# Altium project QR_Scanning_v1.STM32F401RE.PrjPcb
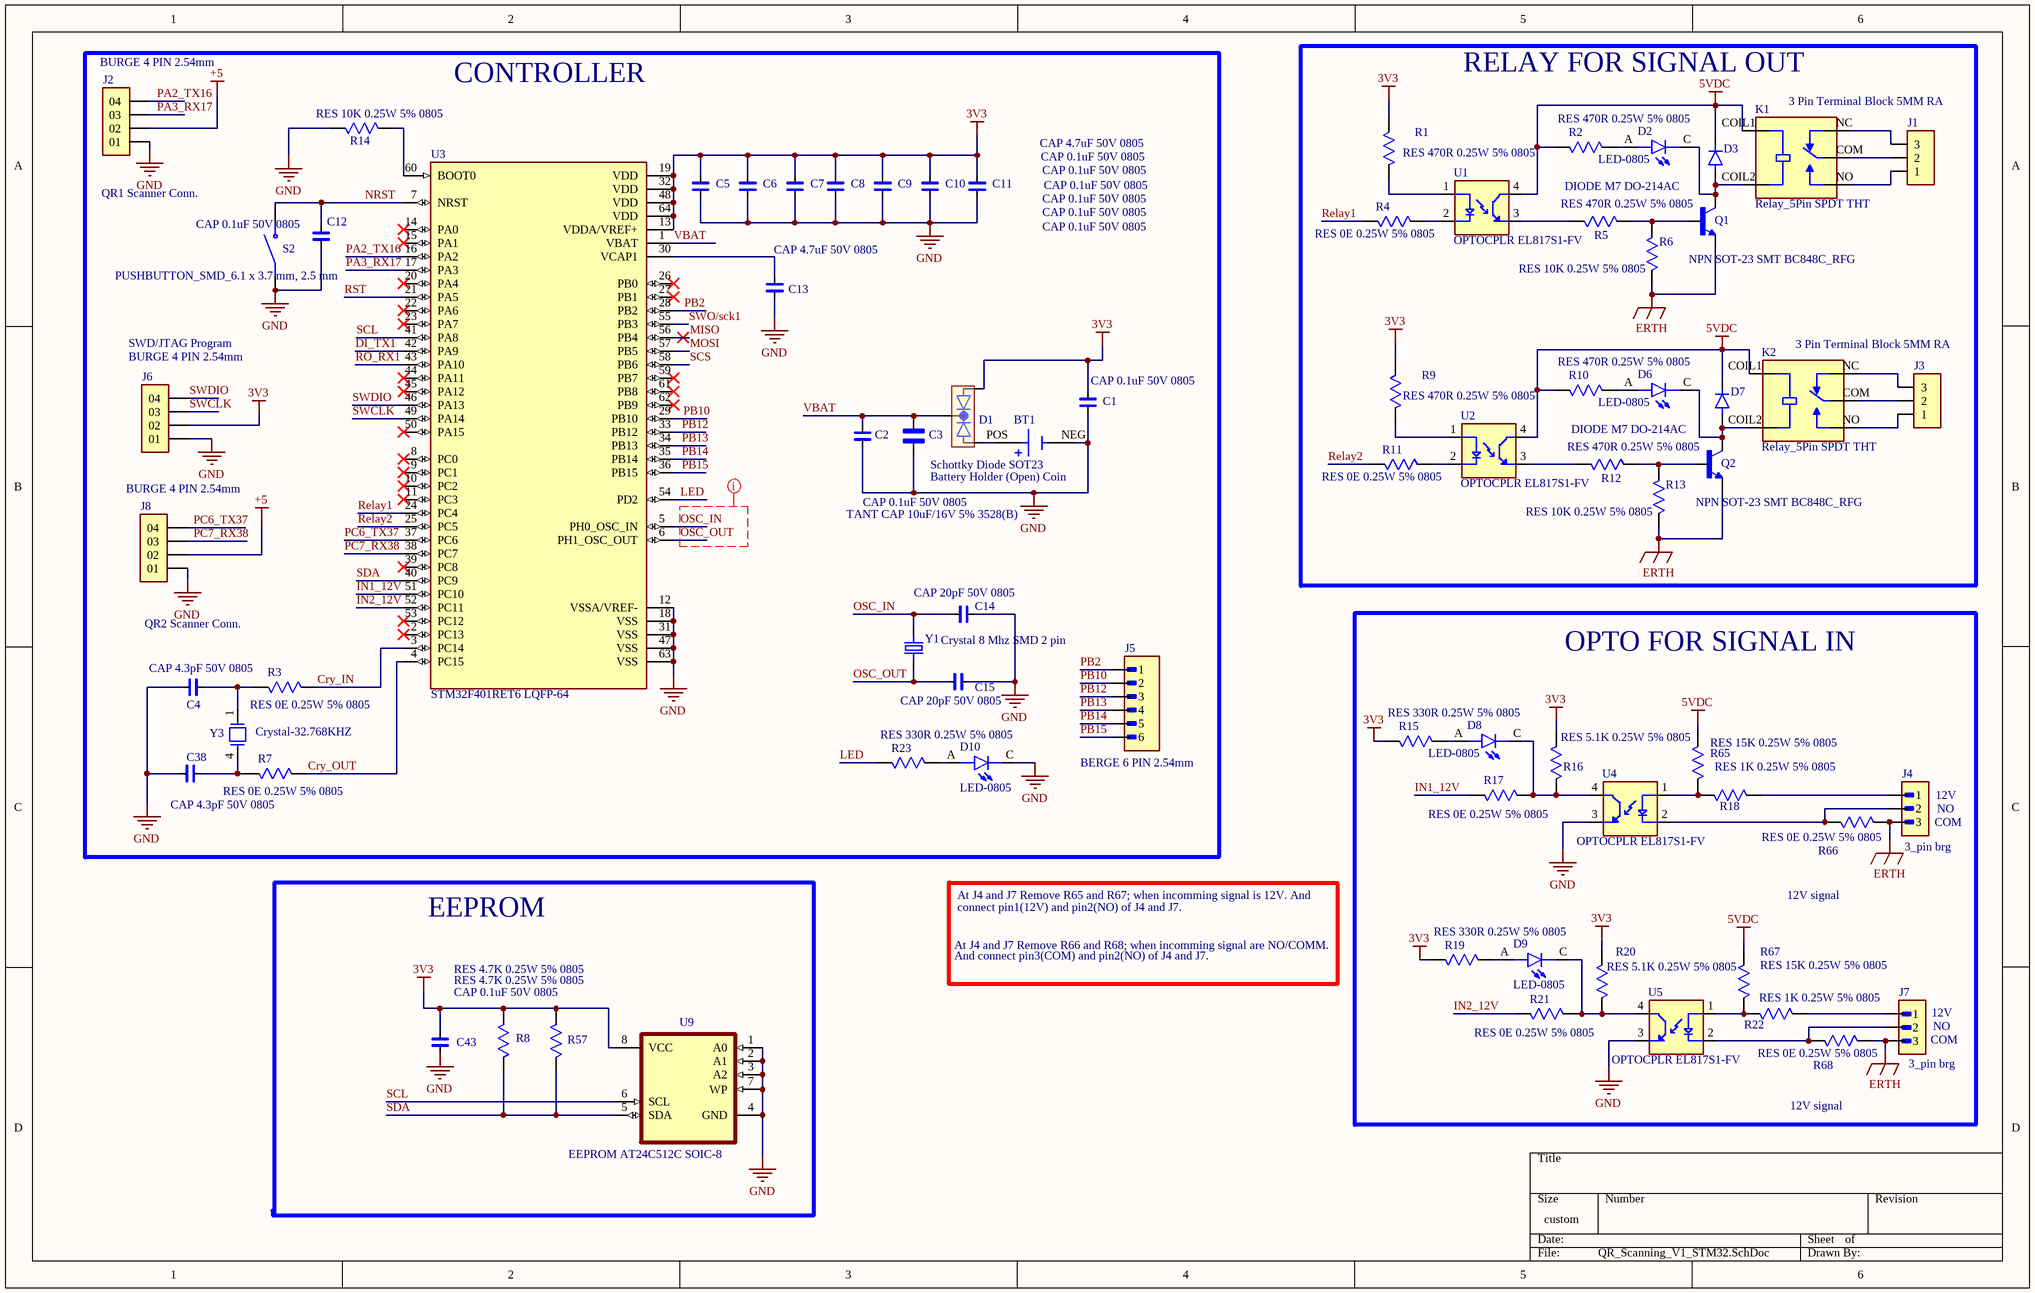
[diagram p0: QR_Scanning_V1_STM32.SchDoc]
3 sheets, 184 parts. Net scope: global (net labels, ports and power ports of the same name join across sheets).
Board file: QR_Scanning_V1_STM32.PcbDoc
Sheets:
  QR_Scanning_V1_STM32.SchDoc
  QR_Scanning1_V1_STM32.SchDoc
  QR_Scanning2_V1_STM32.SchDoc

## Sheet QR_Scanning_V1_STM32.SchDoc
size 381 x 241 mm; SheetNumber: 1; SheetTotal: 3

### Parts
BT1  Battery Holder (Open) Coin  [Battery Holder (Open) Coin]
C1  CAP 0.1uF 50V 0805  [CAP CER 0.1uF/50V 5%]
C2  CAP 0.1uF 50V 0805  [CAP CER 0.1uF/50V 5%]
C3  TANT CAP 10uF/16V 5% 3528(B)  [TANT CAP 3528(B)]
C4  CAP 4.3pF 50V 0805  [CAP CER 0.1uF/50V 5%]
C5  CAP 0.1uF 50V 0805  [CAP CER 0.1uF/50V 5%]
C6  CAP 0.1uF 50V 0805  [CAP CER 0.1uF/50V 5%]
C7  CAP 0.1uF 50V 0805  [CAP CER 0.1uF/50V 5%]
C8  CAP 0.1uF 50V 0805  [CAP CER 0.1uF/50V 5%]
C9  CAP 0.1uF 50V 0805  [CAP CER 0.1uF/50V 5%]
C10  CAP 0.1uF 50V 0805  [CAP CER 0.1uF/50V 5%]
C11  CAP 4.7uF 50V 0805  [CAP CER 0.1uF/50V 5%]
C12  CAP 0.1uF 50V 0805  [CAP CER 0.1uF/50V 5%]
C13  CAP 4.7uF 50V 0805  [CAP CER 0.1uF/50V 5%]
C14  CAP 20pF 50V 0805  [CAP CER 0.1uF/50V 5%]
C15  CAP 20pF 50V 0805  [CAP CER 0.1uF/50V 5%]
C38  CAP 4.3pF 50V 0805  [CAP CER 0.1uF/50V 5%]
C43  CAP 0.1uF 50V 0805  [CAP CER 0.1uF/50V 5%]
D1  Schottky Diode SOT23  [Schottky Diode SOT23 BAT54C]
D2  LED-0805  [LED-0805]
D3  DIODE M7 DO-214AC  [DIODE M7 DO-214AC]
D6  LED-0805  [LED-0805]
D7  DIODE M7 DO-214AC  [DIODE M7 DO-214AC]
D8  LED-0805  [LED-0805]
D9  LED-0805  [LED-0805]
D10  LED-0805  [LED-0805]
J1  3 Pin Terminal Block 5MM RA  [3 Pin Terminal Block 5MM RA]
J2  BURGE 4 PIN 2.54mm  [BURGE 4 PIN 2.54mm]
J3  3 Pin Terminal Block 5MM RA  [3 Pin Terminal Block 5MM RA]
J4  3_pin brg  [3_pin brg]
J5  BERGE 6 PIN 2.54mm  [BERGE 6 PIN 2.54mm]
J6  BURGE 4 PIN 2.54mm  [BURGE 4 PIN 2.54mm]
J7  3_pin brg  [3_pin brg]
J8  BURGE 4 PIN 2.54mm  [BURGE 4 PIN 2.54mm]
K1  Relay_5Pin SPDT THT  [Relay_5Pin SPDT THT]
K2  Relay_5Pin SPDT THT  [Relay_5Pin SPDT THT]
Q1  NPN SOT-23 SMT BC848C_RFG  [NPN SOT-23 SMT BC848C_RFG]
Q2  NPN SOT-23 SMT BC848C_RFG  [NPN SOT-23 SMT BC848C_RFG]
R1  RES 470R 0.25W 5% 0805  [RES 0805 10K/0.25W 5%]
R2  RES 470R 0.25W 5% 0805  [RES 0805 10K/0.25W 5%]
R3  RES 0E 0.25W 5% 0805  [RES 0805 10K/0.25W 5%]
R4  RES 0E 0.25W 5% 0805  [RES 0805 10K/0.25W 5%]
R5  RES 470R 0.25W 5% 0805  [RES 0805 10K/0.25W 5%]
R6  RES 10K 0.25W 5% 0805  [RES 0805 10K/0.25W 5%]
R7  RES 0E 0.25W 5% 0805  [RES 0805 10K/0.25W 5%]
R8  RES 4.7K 0.25W 5% 0805  [RES 0805 10K/0.25W 5%]
R9  RES 470R 0.25W 5% 0805  [RES 0805 10K/0.25W 5%]
R10  RES 470R 0.25W 5% 0805  [RES 0805 10K/0.25W 5%]
R11  RES 0E 0.25W 5% 0805  [RES 0805 10K/0.25W 5%]
R12  RES 470R 0.25W 5% 0805  [RES 0805 10K/0.25W 5%]
R13  RES 10K 0.25W 5% 0805  [RES 0805 10K/0.25W 5%]
R14  RES 10K 0.25W 5% 0805  [RES 0805 10K/0.25W 5%]
R15  RES 330R 0.25W 5% 0805  [RES 0805 10K/0.25W 5%]
R16  RES 5.1K 0.25W 5% 0805  [RES 0805 10K/0.25W 5%]
R17  RES 0E 0.25W 5% 0805  [RES 0805 10K/0.25W 5%]
R18  RES 1K 0.25W 5% 0805  [RES 0805 10K/0.25W 5%]
R19  RES 330R 0.25W 5% 0805  [RES 0805 10K/0.25W 5%]
R20  RES 5.1K 0.25W 5% 0805  [RES 0805 10K/0.25W 5%]
R21  RES 0E 0.25W 5% 0805  [RES 0805 10K/0.25W 5%]
R22  RES 1K 0.25W 5% 0805  [RES 0805 10K/0.25W 5%]
R23  RES 330R 0.25W 5% 0805  [RES 0805 10K/0.25W 5%]
R57  RES 4.7K 0.25W 5% 0805  [RES 0805 10K/0.25W 5%]
R65  RES 15K 0.25W 5% 0805  [RES 0805 10K/0.25W 5%]
R66  RES 0E 0.25W 5% 0805  [RES 0805 10K/0.25W 5%]
R67  RES 15K 0.25W 5% 0805  [RES 0805 10K/0.25W 5%]
R68  RES 0E 0.25W 5% 0805  [RES 0805 10K/0.25W 5%]
S2  PUSHBUTTON_SMD_6.1 x 3.7 mm, 2.5 mm  [PUSHBUTTON_SMD_6.1 x 3.7 mm, 2.5 mm]
U1  OPTOCPLR EL817S1-FV  [OPTOCPLR EL817S1-FV]
U2  OPTOCPLR EL817S1-FV  [OPTOCPLR EL817S1-FV]
U3  STM32F401RET6 LQFP-64  [STM32F401RE Cortex-M4]
U4  OPTOCPLR EL817S1-FV  [OPTOCPLR EL817S1-FV]
U5  OPTOCPLR EL817S1-FV  [OPTOCPLR EL817S1-FV]
U9  EEPROM AT24C512C SOIC-8  [EEPROM AT24C512C SOIC-8]
Y1  Crystal 8 Mhz SMD 2 pin  [Crystal 16 Mhz SMD 2 pin]
Y3  Crystal-32.768KHZ  [Crystal-32.768KHZ]

### Blocks framed on the sheet
CONTROLLER: BT1 C1-C15 C38 D1 D10 J2 J5 J6 J8 R3 R7 R14 R23 S2 U3 Y1 Y3
RELAY FOR SIGNAL OUT: D2 D3 D6 D7 J1 J3 K1 K2 Q1 Q2 R1 R2 R4-R6 R9-R13 U1 U2
OPTO FOR SIGNAL IN: D8 D9 J4 J7 R15-R22 R65-R68 U4 U5

### Nets
3V3: C1.2 C5.2 C6.2 C7.2 C8.2 C9.2 C10.2 C11.2 C43.2 D1.1(A1) J6.02 R1.2 R8.2 R9.2 R15.2 R16.1 R19.2 R20.1 R57.2 U3.13(VDDA/VREF+) U3.19(VDD) U3.32(VDD) U3.48(VDD) U3.64(VDD) U9.8(VCC)
5VDC: D3.C(K) D7.C(K) K1.COIL1 K2.COIL1 R2.2 R10.2 R65.1 R67.1 U1.4(CT) U2.4(CT)
+5: J2.02 J8.02
ERTH: J4.3 J7.3 Q1.2(E) Q2.2(E) R6.1 R13.1 R66.1 R68.1
GND: BT1.NEG C1.1 C2.1 C3.2 C4.2 C5.1 C6.1 C7.1 C8.1 C9.1 C10.1 C11.1 C12.1 C13.1 C14.2 C15.2 C38.2 C43.1 D10.C J2.01 J6.01 J8.01 R14.1 S2.1 U3.12(VSSA/VREF-) U3.18(VSS) U3.31(VSS) U3.47(VSS) U3.63(VSS) U4.3(ET) U5.3(ET) U9.1(A0) U9.2(A1) U9.3(A2) U9.4(GND) U9.7(WP)
Cry_IN: R3.1 U3.3(PC14)
Cry_OUT: R7.1 U3.4(PC15)
DI_TX1: U3.42(PA9)
IN1_12V: R17.2 U3.51(PC10)
IN2_12V: R21.2 U3.52(PC11)
LED: R23.2 U3.54(PD2)
MISO: U3.56(PB4)
MOSI: U3.57(PB5)
NRST: C12.2 S2.2 U3.7(NRST)
OSC_IN: C14.1 U3.5(PH0_OSC_IN) Y1.2
OSC_OUT: C15.1 U3.6(PH1_OSC_OUT) Y1.1
PA2_TX16: J2.04 U3.16(PA2)
PA3_RX17: J2.03 U3.17(PA3)
PB2: J5.1 U3.28(PB2)
PB10: J5.2 U3.29(PB10)
PB12: J5.3 U3.33(PB12)
PB13: J5.4 U3.34(PB13)
PB14: J5.5 U3.35(PB14)
PB15: J5.6 U3.36(PB15)
PC6_TX37: J8.04 U3.37(PC6)
PC7_RX38: J8.03 U3.38(PC7)
Relay1: R4.2 U3.24(PC4)
Relay2: R11.2 U3.25(PC5)
RO_RX1: U3.43(PA10)
RST: U3.21(PA5)
SCL: U3.41(PA8) U9.6(SCL)
SCS: U3.58(PB6)
SDA: R8.1 R57.1 U3.40(PC9) U9.5(SDA)
SWCLK: J6.03 U3.49(PA14)
SWDIO: J6.04 U3.46(PA13)
SWO/sck1: U3.55(PB3)
VBAT: C2.2 C3.1 D1.3(C) U3.1(VBAT)
NetBT1_POS: BT1.POS D1.2(A2)
NetC4_1: C4.1 R3.2 Y3.1
NetC13_2: C13.2 U3.30(VCAP1)
NetC38_1: C38.1 R7.2 Y3.4
NetD2_A: D2.A R2.1
NetD2_C: D2.C D3.A K1.COIL2 Q1.3(C)
NetD6_A: D6.A R10.1
NetD6_C: D6.C D7.A K2.COIL2 Q2.3(C)
NetD8_A: D8.A R15.1
NetD8_C: D8.C R16.2 R17.1 U4.4(CT)
NetD9_A: D9.A R19.1
NetD9_C: D9.C R20.2 R21.1 U5.4(CT)
NetD10_A: D10.A R23.1
NetJ1_1: J1.1 K1.NO
NetJ1_2: J1.2 K1.COM
NetJ1_3: J1.3 K1.NC
NetJ3_1: J3.1 K2.NO
NetJ3_2: J3.2 K2.COM
NetJ3_3: J3.3 K2.NC
NetJ4_1: J4.1 R18.1
NetJ4_2: J4.2 R66.2 U4.2(C)
NetJ7_1: J7.1 R22.1
NetJ7_2: J7.2 R68.2 U5.2(C)
NetQ1_1: Q1.1(B) R5.2 R6.2
NetQ2_1: Q2.1(B) R12.2 R13.2
NetR1_1: R1.1 U1.1(A)
NetR4_1: R4.1 U1.2(C)
NetR5_1: R5.1 U1.3(ET)
NetR9_1: R9.1 U2.1(A)
NetR11_1: R11.1 U2.2(C)
NetR12_1: R12.1 U2.3(ET)
NetR14_2: R14.2 U3.60(BOOT0)
NetR18_2: R18.2 R65.2 U4.1(A)
NetR22_2: R22.2 R67.2 U5.1(A)

Not connected (* = marked no-connect by the designer): U3 2(PC13)* 8(PC0)* 9(PC1)* 10(PC2)* 11(PC3)* 14(PA0)* 15(PA1)* 20(PA4)* 22(PA6)* 23(PA7)* 26(PB0)* 27(PB1)* 39(PC8)* 44(PA11)* 45(PA12)* 50(PA15)* 53(PC12)* 59(PB7)* 61(PB8)* 62(PB9)*

### Layout directives
net class Single_50 ohm: OSC_IN, OSC_OUT

### Notes on the sheet
- (near J2) QR1 Scanner Conn.
- (near J6) SWD/JTAG Program
- QR2 Scanner Conn.
- (near J4) COM
- (near J4) 12V
- (near J4) NO
- At J4 and J7 Remove R65 and R67; when incomming signal is 12V. And
- connect pin1(12V) and pin2(NO) of J4 and J7.
- 12V signal
- EEPROM
- At J4 and J7 Remove R66 and R68; when incomming signal are NO/COMM.
- And connect pin3(COM) and pin2(NO) of J4 and J7.
- (near J7) COM
- (near J7) 12V
- (near J7) NO
- (in symbol TANT CAP 10uF/16V 5% 3528(B)) +

### Library data of the parts
BT1 = Battery Holder (Open) Coin: Battery Holder (Open) Coin, 20.0mm 1 Cell SMD (SMT) Tab, CR2032, BS-7-RED; Package: None; Price: None; Value: *; MP: BS-7-RED; Availability: Unavailable
C1 C2 C4-C15 C38 C43 = CAP CER 0.1uF/50V 5%: CAP CER 0.1uF/50V  Ceramic Capacitor X7R 0805 (2012 Metric) SMT; MF: Samsung; MP: CL21B104KCFNNNE; Purchase-URL: https://pricing.snapeda.com/search?q=CL21B104KCFNNNE&ref=eda; Package: 0805 Samsung; Check_prices: https://www.snapeda.com/parts/CL21B104KCFNNNE/Samsung+Electro-Mechanics/view-part/?ref=eda; Value: *; SnapEDA_Link: https://www.snapeda.com/parts/CL21B104KCFNNNE/Samsung+Electro-Mechanics/view-part/?ref=snap; Digi-Key_Part_Number: 1276-6840-2-ND
C3 = TANT CAP 10uF/16V 5% 3528(B): 10 ÂµF Molded Tantalum Polymer Capacitor 25 V 1411 (3528 Metric), 1210 150mOhm TCJB106M025R0150; MF: AVX; SnapEDA_Link: https://www.snapeda.com/parts/TCJB106M025R0150/AVX/view-part/?ref=snap; Package: 1210 AVX; Value: *; MP: TCJB106M025R0150; Check_prices: https://www.snapeda.com/parts/TCJB106M025R0150/AVX/view-part/?ref=eda
D1 = Schottky Diode SOT23 BAT54C: Schottky Diode 2x ComCath 0.2A 30V SOT23 | Diodes Inc BAT54C; MF: Diodes Inc.; MP: BAT54C-7-F; SnapEDA_Link: https://www.snapeda.com/parts/BAT54C-7-F/Diodes+Inc./view-part/?ref=snap; Package: SOT-23 Diodes Inc.; Value: *; Check_prices: https://www.snapeda.com/parts/BAT54C-7-F/Diodes+Inc./view-part/?ref=eda
D2 D6 D8-D10 = LED-0805: Red 640nm LED Indication - Discrete 1.85V 0805 (2012 Metric) APT2012SRCPRV; MF: Kingbright; SnapEDA_Link: https://www.snapeda.com/parts/APT2012SRCPRV/Kingbright/view-part/?ref=snap; Package: 0805 Kingbright; Value: *; MP: APT2012SRCPRV; Check_prices: https://www.snapeda.com/parts/APT2012SRCPRV/Kingbright/view-part/?ref=eda
D3 D7 = DIODE M7 DO-214AC: M7 General Purpose SMD Rectifier Diode SMA (DO-214AC) 1A 1000V 1n4007 RS2MA; MF: Taiwan Semiconductor; SnapEDA_Link: https://www.snapeda.com/parts/RS2MA/Taiwan+Semiconductor/view-part/?ref=snap; Package: DO-214AC-2 Taiwan Semiconductor; Value: *; MP: RS2MA; Check_prices: https://www.snapeda.com/parts/RS2MA/Taiwan+Semiconductor/view-part/?ref=eda
J1 J3 = 3 Pin Terminal Block 5MM RA: 3 Pin Terminal Block HDR 5MM THT RA 231-433_001-000; MP: 231-433/001-000; MF: WAGO; SnapEDA_Link: https://www.snapeda.com/parts/231-433/001-000/WAGO/view-part/482062/?ref=snap; Package: None; Availability: Unavailable; Price: None; Value: *
J2 J6 J8 = BURGE 4 PIN 2.54mm: Conn Unshrouded Header HDR 4 POS 2.54mm Solder ST Top Entry Thru-Hole Bulk TSW-104-17-G-S-LL; MF: Samtec; MP: TSW-104-23-H-S-LL; SnapEDA_Link: https://www.snapeda.com/parts/TSW-104-23-H-S-LL/Samtec/view-part/?ref=snap; Package: None; Value: *; Check_prices: https://www.snapeda.com/parts/TSW-104-23-H-S-LL/Samtec/view-part/?ref=eda
J4 J7 = 3_pin brg: 3_pin burge 2.54mm; MP: 68001-403HLF; Package: None; Price: None; Value: *; Availability: Unavailable
J5 = BERGE 6 PIN 2.54mm: BergStik, Board to Board connector, Unshrouded Vertical Header, Through Hole, Single Row, 6 Positions, 2.54 mm (0.100in) Pitch. 68604-406HLF; MF: AMPHENOL ICC / FCI; SnapEDA_Link: https://www.snapeda.com/parts/68604-406HLF/Amphenol/view-part/?ref=snap; Package: None; Value: *; MP: 68604-406HLF; Check_prices: https://www.snapeda.com/parts/68604-406HLF/Amphenol/view-part/?ref=eda
K1 K2 = Relay_5Pin SPDT THT: Relays General Purpose Non Latching 3VDC SPDT 10A (250VAC) Max 5PIN SRD-03VDC-SL-C; MF: Songle Relay; SnapEDA_Link: https://www.snapeda.com/parts/SRD-03VDC-SL-C/Songle+Relay/view-part/?ref=snap; Package: NON STANDARD-5 Songle Relay; Value: *; MP: SRD-03VDC-SL-C; Check_prices: https://www.snapeda.com/parts/SRD-03VDC-SL-C/Songle+Relay/view-part/?ref=eda
Q1 Q2 = NPN SOT-23 SMT BC848C_RFG: NPN SMT BC848C_RFG SOT-23, 30V, 0.1A, NPN Transistor; MF: Taiwan Semiconductor; MP: BC848C RFG; SnapEDA_Link: https://www.snapeda.com/parts/BC848C%20RFG/Taiwan+Semiconductor/view-part/?ref=snap; Package: SOT-23 Taiwan Semiconductor; Value: *; Check_prices: https://www.snapeda.com/parts/BC848C%20RFG/Taiwan+Semiconductor/view-part/?ref=eda
R1-R23 R57 R65-R68 = RES 10K 0.25W 5% 0805: RESISTOR, THICK FILM, 10K, 5%, 0805 0.25W SMT; MP: ERJ-6GEYJ103V; MF: Panasonic Electronic; Price: None; Check_prices: https://www.snapeda.com/parts/ERJ-6GEYJ103V/Panasonic+Electronic+Components/view-part/?ref=eda; Package: 805-2 Panasonic; Purchase-URL: https://pricing.snapeda.com/search/part/ERJ-6GEYJ103V/?ref=eda; Availability: In Stock; SnapEDA_Link: https://www.snapeda.com/parts/ERJ-6GEYJ103V/Panasonic+Electronic+Components/view-part/?ref=snap; Value: *
S2 = PUSHBUTTON_SMD_6.1 x 3.7 mm, 2.5 mm: 6.1 x 3.7 mm, 2.5 mm Actuator Height, 260 gf, Red, Surface Mount, SPST, Tactile Switch, TS09-63-25-R-260-SMT-TR; MF: Same Sky; SnapEDA_Link: https://www.snapeda.com/parts/TS09-63-25-R-260-SMT-TR/Same+Sky/view-part/?ref=snap; Package: None; Value: *; MP: TS09-63-25-R-260-SMT-TR; Check_prices: https://www.snapeda.com/parts/TS09-63-25-R-260-SMT-TR/Same+Sky/view-part/?ref=eda
U1 U2 U4 U5 = Optclr EL817S1-FV: Optoisoltr 5kv Transistor 4-Smd EL817S1-FV; MF: {'manufacturer': u'Everlight Electronics Co Ltd'}; MP: EL817S1(A)(TU)-V; Package: None; Price: None; Value: *; Availability: Unavailable
U3 = STM32F401RET6: ARMÂ® CortexÂ®-M4 STM32F4 Microcontroller IC 32-Bit Single-Core 84MHz 512KB (512K x 8) FLASH 64-LQFP (10x10); MF: STMicroelectronics; SnapEDA_Link: https://www.snapeda.com/parts/STM32F401RET6/STMicroelectronics/view-part/?ref=snap; Package: LQFP-64 STMicroelectronics; Value: *; MP: STM32F401RET6; Check_prices: https://www.snapeda.com/parts/STM32F401RET6/STMicroelectronics/view-part/?ref=eda
U9 = EEPROM AT24C512C SOIC-8: EEPROM Memory IC 512Kb (64K x 8) IÂ²C 400 kHz 900 ns SOIC-8 AT24C512C-SSHM-T; MF: Microchip; SnapEDA_Link: https://www.snapeda.com/parts/AT24C512C-SSHM-T/Microchip/view-part/?ref=snap; Package: SO-8 Microchip; Value: *; MP: AT24C512C-SSHM-T; Check_prices: https://www.snapeda.com/parts/AT24C512C-SSHM-T/Microchip/view-part/?ref=eda
Y1 = Crystal 16 Mhz SMD 2 pin_1: 16 MHz Â±30ppm Crystal 20pF 60 Ohms HC-49/US FOXSDLF/128-20 16 Mhz Crystal SMD –CSM-4ALX(28ALX) 12.5mmX4.85mmX4mm; MF: Fox Electronics; SnapEDA_Link: https://www.snapeda.com/parts/FOXSDLF/128-20/Fox+Electronics/view-part/?ref=snap; Package: HC49SD Fox Electronics; Value: *; MP: FOXSDLF/128-20; Check_prices: https://www.snapeda.com/parts/FOXSDLF/128-20/Fox+Electronics/view-part/?ref=eda
Y3 = Crystal-32.768KHZ: 32.768 kHz Â±20ppm Crystal 6pF 50 kOhms 4-SOJ, 5.50mm pitch ABS25-32.768KHZ-6-T; MF: Abracon; SnapEDA_Link: https://www.snapeda.com/parts/ABS25-32.768KHZ-6-T/Abracon/view-part/?ref=snap; Package: 4-4 Abracon; Value: *; MP: ABS25-32.768KHZ-6-T; Check_prices: https://www.snapeda.com/parts/ABS25-32.768KHZ-6-T/Abracon/view-part/?ref=eda

## Sheet QR_Scanning1_V1_STM32.SchDoc
size 381 x 241 mm; SheetNumber: 2; SheetTotal: 3
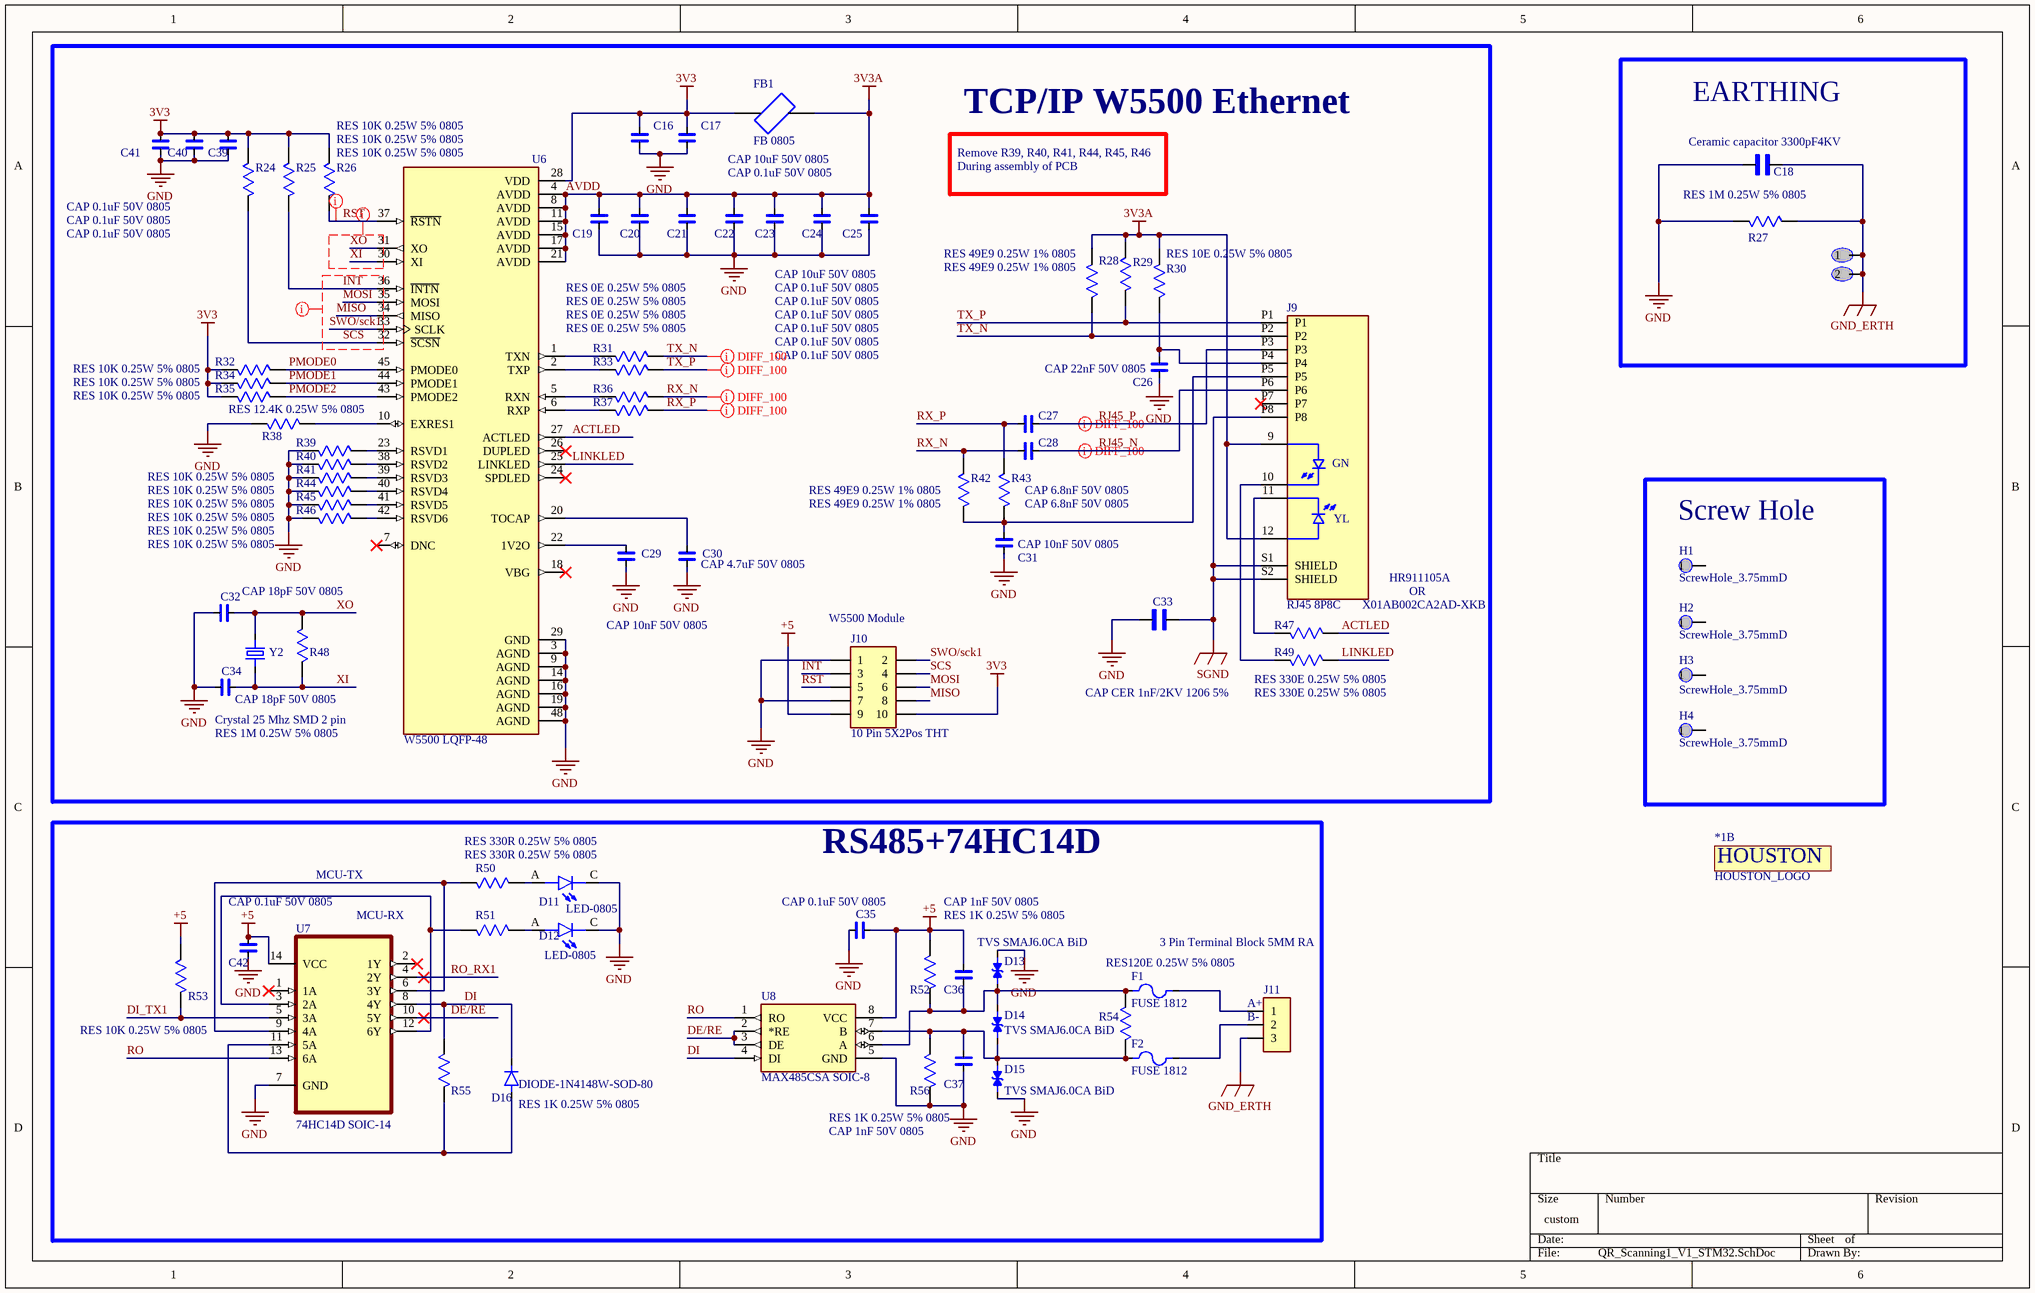
[diagram p1: QR_Scanning1_V1_STM32.SchDoc]

### Parts
*1  HOUSTON_LOGO  [HOUSTON_LOGO]  (part B of 2)
C16  CAP 0.1uF 50V 0805  [CAP CER 0.1uF/50V 5%]
C17  CAP 10uF 50V 0805  [CAP CER 0.1uF/50V 5%]
C18  Ceramic capacitor 3300pF4KV  [Ceramic capacitor 3300pF4KV]
C19  CAP 0.1uF 50V 0805  [CAP CER 0.1uF/50V 5%]
C20  CAP 0.1uF 50V 0805  [CAP CER 0.1uF/50V 5%]
C21  CAP 0.1uF 50V 0805  [CAP CER 0.1uF/50V 5%]
C22  CAP 0.1uF 50V 0805  [CAP CER 0.1uF/50V 5%]
C23  CAP 0.1uF 50V 0805  [CAP CER 0.1uF/50V 5%]
C24  CAP 0.1uF 50V 0805  [CAP CER 0.1uF/50V 5%]
C25  CAP 10uF 50V 0805  [CAP CER 0.1uF/50V 5%]
C26  CAP 22nF 50V 0805  [CAP CER 0.1uF/50V 5%]
C27  CAP 6.8nF 50V 0805  [CAP CER 0.1uF/50V 5%]
C28  CAP 6.8nF 50V 0805  [CAP CER 0.1uF/50V 5%]
C29  CAP 10nF 50V 0805  [CAP CER 0.1uF/50V 5%]
C30  CAP 4.7uF 50V 0805  [CAP CER 0.1uF/50V 5%]
C31  CAP 10nF 50V 0805  [CAP CER 0.1uF/50V 5%]
C32  CAP 18pF 50V 0805  [CAP CER 0.1uF/50V 5%]
C33  CAP CER 1nF/2KV 1206 5%  [CAP CER 1nF/2KV 1206 5%]
C34  CAP 18pF 50V 0805  [CAP CER 0.1uF/50V 5%]
C35  CAP 0.1uF 50V 0805  [CAP CER 0.1uF/50V 5%]
C36  CAP 1nF 50V 0805  [CAP CER 0.1uF/50V 5%]
C37  CAP 1nF 50V 0805  [CAP CER 0.1uF/50V 5%]
C39  CAP 0.1uF 50V 0805  [CAP CER 0.1uF/50V 5%]
C40  CAP 0.1uF 50V 0805  [CAP CER 0.1uF/50V 5%]
C41  CAP 0.1uF 50V 0805  [CAP CER 0.1uF/50V 5%]
C42  CAP 0.1uF 50V 0805  [CAP CER 0.1uF/50V 5%]
D11  LED-0805  [LED-0805]
D12  LED-0805  [LED-0805]
D13  TVS SMAJ6.0CA BiD  [TVS SMAJ6.0CA DO-214AC (SMA)]
D14  TVS SMAJ6.0CA BiD  [TVS SMAJ6.0CA DO-214AC (SMA)]
D15  TVS SMAJ6.0CA BiD  [TVS SMAJ6.0CA DO-214AC (SMA)]
D16  DIODE-1N4148W-SOD-80  [DIODE-1N4148W-SOD-80]
EARTHING_VIA_HOLE_3.65MM  EARTHING_VIA HOLE_3.65MM  [EARTHING_VIA HOLE_3.65MM]  (value not drawn)
F1  FUSE 1812  [FUSE 1812]
F2  FUSE 1812  [FUSE 1812]
FB1  FB 0805  [FB 0805]
H1  ScrewHole_3.75mmD  [ScrewHole_3.75mmD - duplicate]
H2  ScrewHole_3.75mmD  [ScrewHole_3.75mmD - duplicate]
H3  ScrewHole_3.75mmD  [ScrewHole_3.75mmD - duplicate]
H4  ScrewHole_3.75mmD  [ScrewHole_3.75mmD - duplicate]
J9  RJ45 8P8C  [RJ45 8P8C]
J10  10 Pin 5X2Pos THT  [10 Pin 5X2Pos THT]
J11  3 Pin Terminal Block 5MM RA  [3 Pin Terminal Block 5MM RA]
R24  RES 10K 0.25W 5% 0805  [RES 0805 10K/0.25W 5%]
R25  RES 10K 0.25W 5% 0805  [RES 0805 10K/0.25W 5%]
R26  RES 10K 0.25W 5% 0805  [RES 0805 10K/0.25W 5%]
R27  RES 1M 0.25W 5% 0805  [RES 0805 10K/0.25W 5%]
R28  RES 49E9 0.25W 1% 0805  [RES 0805 10K/0.25W 5%]
R29  RES 49E9 0.25W 1% 0805  [RES 0805 10K/0.25W 5%]
R30  RES 10E 0.25W 5% 0805  [RES 0805 10K/0.25W 5%]
R31  RES 0E 0.25W 5% 0805  [RES 0805 10K/0.25W 5%]
R32  RES 10K 0.25W 5% 0805  [RES 0805 10K/0.25W 5%]
R33  RES 0E 0.25W 5% 0805  [RES 0805 10K/0.25W 5%]
R34  RES 10K 0.25W 5% 0805  [RES 0805 10K/0.25W 5%]
R35  RES 10K 0.25W 5% 0805  [RES 0805 10K/0.25W 5%]
R36  RES 0E 0.25W 5% 0805  [RES 0805 10K/0.25W 5%]
R37  RES 0E 0.25W 5% 0805  [RES 0805 10K/0.25W 5%]
R38  RES 12.4K 0.25W 5% 0805  [RES 0805 10K/0.25W 5%]
R39  RES 10K 0.25W 5% 0805  [RES 0805 10K/0.25W 5%]
R40  RES 10K 0.25W 5% 0805  [RES 0805 10K/0.25W 5%]
R41  RES 10K 0.25W 5% 0805  [RES 0805 10K/0.25W 5%]
R42  RES 49E9 0.25W 1% 0805  [RES 0805 10K/0.25W 5%]
R43  RES 49E9 0.25W 1% 0805  [RES 0805 10K/0.25W 5%]
R44  RES 10K 0.25W 5% 0805  [RES 0805 10K/0.25W 5%]
R45  RES 10K 0.25W 5% 0805  [RES 0805 10K/0.25W 5%]
R46  RES 10K 0.25W 5% 0805  [RES 0805 10K/0.25W 5%]
R47  RES 330E 0.25W 5% 0805  [RES 0805 10K/0.25W 5%]
R48  RES 1M 0.25W 5% 0805  [RES 0805 10K/0.25W 5%]
R49  RES 330E 0.25W 5% 0805  [RES 0805 10K/0.25W 5%]
R50  RES 330R 0.25W 5% 0805  [RES 0805 10K/0.25W 5%]
R51  RES 330R 0.25W 5% 0805  [RES 0805 10K/0.25W 5%]
R52  RES 1K 0.25W 5% 0805  [RES 0805 10K/0.25W 5%]
R53  RES 10K 0.25W 5% 0805  [RES 0805 10K/0.25W 5%]
R54  RES120E 0.25W 5% 0805  [RES 0805 10K/0.25W 5%]
R55  RES 1K 0.25W 5% 0805  [RES 0805 10K/0.25W 5%]
R56  RES 1K 0.25W 5% 0805  [RES 0805 10K/0.25W 5%]
U6  W5500 LQFP-48  [W5500 LQFP-48]
U7  74HC14D SOIC-14  [74HC14D SOIC-14]
U8  MAX485CSA SOIC-8  [MAX485CSA]
Y2  Crystal 25 Mhz SMD 2 pin  [Crystal 16 Mhz SMD 2 pin]

### Blocks framed on the sheet
TCP/IP W5500 Ethernet: C16 C17 C19-C34 C39-C41 FB1 J9 J10 R24-R26 R28-R49 U6 Y2
EARTHING: C18 EARTHING_VIA_HOLE_3.65MM R27
Screw Hole: H1-H4
RS485+74HC14D: C35-C37 C42 D11-D16 F1 F2 J11 R50-R56 U7 U8

### Nets
3V3: C16.2 C17.2 C39.2 C40.2 C41.2 FB1.1 J10.10 R24.2 R25.2 R26.2 R32.2 R34.2 R35.2 U6.28(VDD)
+5: C35.1 C36.2 C42.2 J10.9 R52.1 R53.2 U7.14(VCC) U8.8(VCC)
AVDD: C19.2 C20.2 C21.2 C22.2 C23.2 C24.2 C25.2 FB1.2 J9.9 J9.12 R28.2 R29.2 R30.2 U6.4(AVDD) U6.8(AVDD) U6.11(AVDD) U6.15(AVDD) U6.17(AVDD) U6.21(AVDD)  [also labelled 3V3A]
GND: C16.1 C17.1 C18.1 C19.1 C20.1 C21.1 C22.1 C23.1 C24.1 C25.1 C26.1 C29.1 C30.1 C31.1 C32.2 C33.1 C34.2 C35.2 C37.2 C39.1 C40.1 C41.1 C42.1 D11.C D12.C D13.2 D15.1 J10.1 J10.7 R27.1 R38.1 R39.2 R40.2 R41.2 R44.2 R45.2 R46.2 R56.1 U6.3(AGND) U6.9(AGND) U6.14(AGND) U6.16(AGND) U6.19(AGND) U6.29(GND) U6.48(AGND) U7.7(GND) U8.5(GND)
GND_ERTH: C18.2 EARTHING_VIA_HOLE_3.65MM.1 EARTHING_VIA_HOLE_3.65MM.2 J11.3 R27.2
SGND: C33.2 J9.P8 J9.S1(SHIELD) J9.S2(SHIELD)
ACTLED: R47.1 U6.27(ACTLED)
DE/RE: U7.10(5Y) U8.2(*RE) U8.3(DE)
DI: D16.C(K) R55.2 U7.8(4Y) U8.4(DI)
DI_TX1: R53.1 U7.5(3A)
INT: J10.3 R25.1 U6.36(~{INTN})
LINKLED: R49.1 U6.25(LINKLED)
MISO: J10.8 U6.34(MISO)
MOSI: J10.6 U6.35(MOSI)
PMODE0: R32.1 U6.45(PMODE0)
PMODE1: R34.1 U6.44(PMODE1)
PMODE2: R35.1 U6.43(PMODE2)
RJ45_N: C28.1 J9.P6
RJ45_P: C27.1 J9.P3
RO: U7.13(6A) U8.1(RO)
RO_RX1: U7.4(2Y)
RST: J10.5 R26.1 U6.37(~{RSTN})
RX_N: C28.2 R36.1 R42.2
RX_P: C27.2 R37.1 R43.2
SCS: J10.4 R24.1 U6.32(~{SCSN})
SWO/sck1: J10.2 U6.33(SCLK)
TX_N: J9.P2 R28.1 R31.1
TX_P: J9.P1 R29.1 R33.1
XI: C34.1 R48.1 U6.30(XI) Y2.2
XO: C32.1 R48.2 U6.31(XO) Y2.1
NetC26_2: C26.2 J9.P4 R30.1
NetC29_2: C29.2 U6.22(1V2O)
NetC30_2: C30.2 U6.20(TOCAP)
NetC31_2: C31.2 J9.P5 R42.1 R43.1
NetC36_1: C36.1 D13.1 D14.2 F1.1 R52.2 R54.2 U8.6(A)
NetC37_1: C37.1 D14.1 D15.2 F2.1 R54.1 R56.2 U8.7(B)
NetD11_A: D11.A R50.1
NetD12_A: D12.A R51.1
NetD16_A: D16.A R55.1 U7.11(5A)
NetF1_2: F1.2 J11.1
NetF2_2: F2.2 J11.2
NetJ9_10: J9.10 R49.2
NetJ9_11: J9.11 R47.2
NetR31_2: R31.2 U6.1(TXN)
NetR33_2: R33.2 U6.2(TXP)
NetR36_2: R36.2 U6.5(RXN)
NetR37_2: R37.2 U6.6(RXP)
NetR38_2: R38.2 U6.10(EXRES1)
NetR39_1: R39.1 U6.23(RSVD1)
NetR40_1: R40.1 U6.38(RSVD2)
NetR41_1: R41.1 U6.39(RSVD3)
NetR44_1: R44.1 U6.40(RSVD4)
NetR45_1: R45.1 U6.41(RSVD5)
NetR46_1: R46.1 U6.42(RSVD6)
NetR50_2: R50.2 U7.6(3Y) U7.9(4A)
NetR51_2: R51.2 U7.3(2A) U7.12(6Y)

Not connected (* = marked no-connect by the designer): H1 1; H2 1; H3 1; H4 1; J9 P7*; U6 7(DNC)* 18(VBG)* 24(SPDLED)* 26(DUPLED)*; U7 1(1A)* 2(1Y)*

### Layout directives
net class Single_50 ohm: INT, MISO, MOSI, RST, SCS, SWO/sck1, XI, XO
differential pair; differential pair class DIFF_100: RJ45_N, RJ45_P, RX_N, RX_P, TX_N, TX_P

### Notes on the sheet
- Remove R39, R40, R41, R44, R45, R46
- During assembly of PCB
- (near J10) W5500 Module
- X01AB002CA2AD-XKB
- HR911105A
- OR
- MCU-TX
- (near U7) MCU-RX
- (near J11) B-
- (near J11) A+
- (in symbol HOUSTON_LOGO, part B) HOUSTON
- (in symbol RJ45 8P8C) GN; YL

### Library data of the parts
C16 C17 C19-C32 C34-C37 C39-C42 = CAP CER 0.1uF/50V 5%: as C1 on sheet QR_Scanning_V1_STM32; Purchase-URL: https://pricing.snapeda.com/search?q=CL21B104KCFNNNE&ref=eda; Package: 0805 Samsung; Check_prices: https://www.snapeda.com/parts/CL21B104KCFNNNE/Samsung+Electro-Mechanics/view-part/?ref=eda; Value: *; SnapEDA_Link: https://www.snapeda.com/parts/CL21B104KCFNNNE/Samsung+Electro-Mechanics/view-part/?ref=snap; Digi-Key_Part_Number: 1276-6840-2-ND
C18 = Ceramic capacitor 3300pF4KV: Ceramic capacitor 3300pF4KV, Tension nominale 400Vac(r.m.s.), 4KV ESD, DE2E3SA332MA3BY02F; MF: Murata; Package: NONSTANDARD; Value: *; Purchase-URL: https://pricing.snapeda.com/search/part/DE2E3SA332MA3BY02F/?ref=eda; Availability: Bad; SnapEDA_Link: https://www.snapeda.com/parts/DE2E3SA332MA3BY02F/Murata/view-part/2799752/?ref=snap; Price: None; MP: DE2E3SA332MA3BY02F; Check_prices: https://www.snapeda.com/parts/DE2E3SA332MA3BY02F/Murata/view-part/2799752/?ref=eda
C33 = CAP CER 1nF/2KV 1206 5%: 1000 pF Â±10% 2000V (2kV) Ceramic Capacitor X7R 1206 (3216 Metric) C1206C102KGRACAUTO; MF: KEMET; SnapEDA_Link: https://www.snapeda.com/parts/C1206C102KGRACAUTO/KEMET/view-part/?ref=snap; Package: 3216 KEMET; Value: *; MP: C1206C102KGRACAUTO; Check_prices: https://www.snapeda.com/parts/C1206C102KGRACAUTO/KEMET/view-part/?ref=eda
D11 D12 = LED-0805: as D2 on sheet QR_Scanning_V1_STM32; SnapEDA_Link: https://www.snapeda.com/parts/APT2012SRCPRV/Kingbright/view-part/?ref=snap; Package: 0805 Kingbright; Value: *; MP: APT2012SRCPRV; Check_prices: https://www.snapeda.com/parts/APT2012SRCPRV/Kingbright/view-part/?ref=eda
D13-D15 = TVS SMAJ6.0CA DO-214AC (SMA): SMAJ6.0CA WG Bidirectional TVS diode littlefuse DO-214AC (SMA); MP: SMAJ7.5CA; Availability: Unavailable; Package: None; Value: *; Price: None
D16 = DIODE-1N4148W-SOD-80: DIODE-1N4148W-SOD-80 is a general-purpose silicon diode LL4148_L1G; MP: LL4148_L1G; Price: None; Package: None; Availability: Unavailable; Value: *
F1 F2 = FUSE 1812: Polymeric PTC Resettable Fuse 60V 100 mA Ih Surface Mount 1812 (4532 Metric), Concave, MF-MSMF010-2; MF: Bourns; Price: None; Availability: In Stock; MP: MF-MSMF010-2; Package: 1812 Bourns; SnapEDA_Link: https://www.snapeda.com/parts/MF-MSMF010-2/Bourns/view-part/?ref=snap; Check_prices: https://www.snapeda.com/parts/MF-MSMF010-2/Bourns/view-part/?ref=eda; Value: *; Purchase-URL: https://pricing.snapeda.com/search/part/MF-MSMF010-2/?ref=eda
FB1 = FB 0805: MH2029-101Y-Bourns Inc.-Ferrite Bead, 100 Ohms @ 100 MHz , Signal Line Ferrite Bead 0805 (2012 Metric) 2A 100mOhm; MP: MPZ2012S102AT000; Package: None; Price: None; Value: *; Availability: Unavailable
H1-H4 = ScrewHole_3.75mmD: SCREW HEAD DIA 4.5MM, SREW LEG DIA 3 MM
J9 = RJ45 8P8C: 10/100 BaseT, 8P8C, Horizontal, Shielded, LED, Through Hole, 6 Âµin Plating, RJ45 with Integrated Magnetics Modular Connector CRJ011-ML1-TH; MF: Same Sky; SnapEDA_Link: https://www.snapeda.com/parts/CRJ011-ML1-TH/Same+Sky/view-part/?ref=snap; Package: None; Value: *; MP: CRJ011-ML1-TH; Check_prices: https://www.snapeda.com/parts/CRJ011-ML1-TH/Same+Sky/view-part/?ref=eda
J10 = 10 Pin 5X2Pos THT: 10 Pin 5X2Pos THT BergeStick 2.54MM MTSW-105-X-X-D-X; MF: {'manufacturer': u'Samtec Inc.'}; Package: None; Price: None; Value: *; MP: MTSW-105-X-X-D-X; Availability: Unavailable
J11 = 3 Pin Terminal Block 5MM RA: as J1 on sheet QR_Scanning_V1_STM32; SnapEDA_Link: https://www.snapeda.com/parts/231-433/001-000/WAGO/view-part/482062/?ref=snap; Package: None; Availability: Unavailable; Price: None; Value: *
R24-R26 R28-R56 = RES 10K 0.25W 5% 0805: as R1 on sheet QR_Scanning_V1_STM32; Price: None; Check_prices: https://www.snapeda.com/parts/ERJ-6GEYJ103V/Panasonic+Electronic+Components/view-part/?ref=eda; Package: 805-2 Panasonic; Purchase-URL: https://pricing.snapeda.com/search/part/ERJ-6GEYJ103V/?ref=eda; Availability: In Stock; SnapEDA_Link: https://www.snapeda.com/parts/ERJ-6GEYJ103V/Panasonic+Electronic+Components/view-part/?ref=snap; Value: *
R27 = RES 10K 0.25W 5% 0805: RESISTOR, THICK FILM, 1M, 5%, 0805 0.25W SMT; MP: ERJ-6GEYJ103V; MF: Panasonic Electronic; Price: None; Check_prices: https://www.snapeda.com/parts/ERJ-6GEYJ103V/Panasonic+Electronic+Components/view-part/?ref=eda; Package: 805-2 Panasonic; Purchase-URL: https://pricing.snapeda.com/search/part/ERJ-6GEYJ103V/?ref=eda; Availability: In Stock; SnapEDA_Link: https://www.snapeda.com/parts/ERJ-6GEYJ103V/Panasonic+Electronic+Components/view-part/?ref=snap; Value: *
U6 = W5500: W5500 LQFP-48 Hardwired TCP/IP embedded Ethernet controller; Availability: Unavailable; MP: W5500; Value: *; Price: None; Package: None
U7 = 74HC14D,653: Inverter IC 6 Channel Schmitt Trigger 14-SO/SOIC-14; MF: Nexperia USA; SnapEDA_Link: https://www.snapeda.com/parts/74HC14D,653/Nexperia/view-part/?ref=snap; Package: SO14-14 Nexperia USA Inc.; Value: *; MP: 74HC14D,653; Check_prices: https://www.snapeda.com/parts/74HC14D,653/Nexperia/view-part/?ref=eda
U8 = MAX485CSA: MAX485CSA-RS-485/RS-422 Transceivers, SOIC-8; MF: Analog Devices; MP: MAX485CSA+; SnapEDA_Link: https://www.snapeda.com/parts/MAX485CSA+/Analog+Devices/view-part/?ref=snap; Package: SOIC-8 Maxim; Value: *; Check_prices: https://www.snapeda.com/parts/MAX485CSA+/Analog+Devices/view-part/?ref=eda
Y2 = Crystal 16 Mhz SMD 2 pin_1: as Y1 on sheet QR_Scanning_V1_STM32; SnapEDA_Link: https://www.snapeda.com/parts/FOXSDLF/128-20/Fox+Electronics/view-part/?ref=snap; Package: HC49SD Fox Electronics; Value: *; MP: FOXSDLF/128-20; Check_prices: https://www.snapeda.com/parts/FOXSDLF/128-20/Fox+Electronics/view-part/?ref=eda

## Sheet QR_Scanning2_V1_STM32.SchDoc: QR_Scanning_V1_STM32
size 381 x 241 mm; ApprovedBy: VARUN; CheckedBy: VARUN; Author: non; CompanyName: Houston Systom Pvt. Ltd.; DrawnBy: VARUN; Engineer: VARUN; Address1: Greator Noida; SheetNumber: 3; SheetTotal: 3
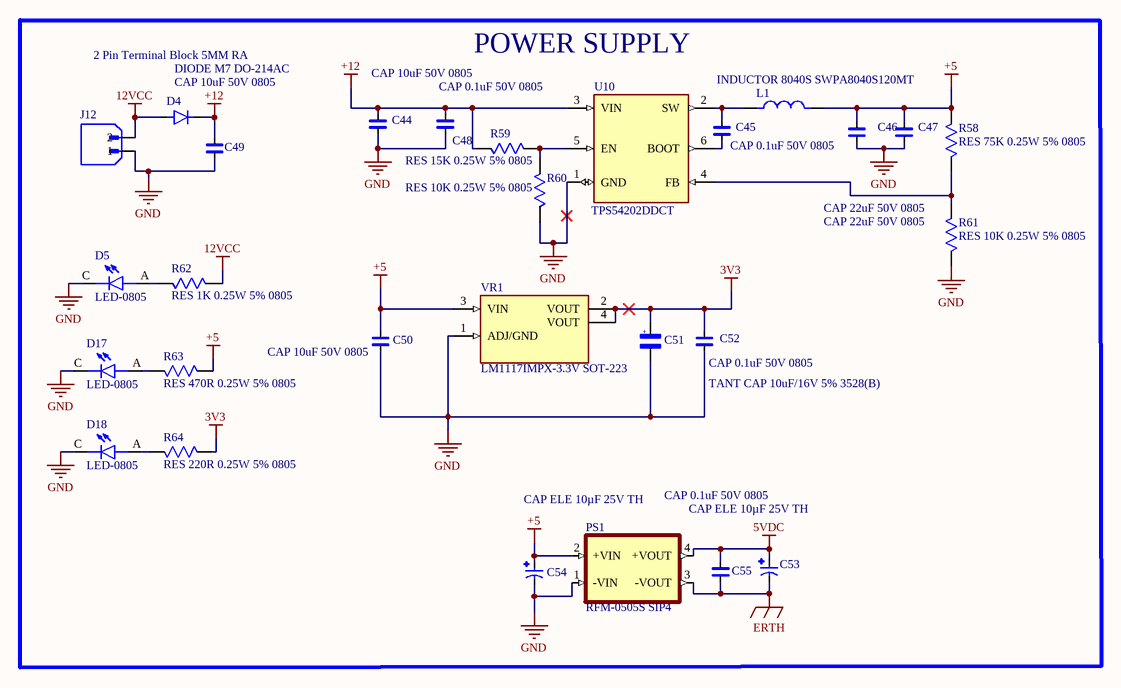
[diagram p2: QR_Scanning2_V1_STM32.SchDoc]

### Parts
C44  CAP 10uF 50V 0805  [CAP CER 0.1uF/50V 5%]
C45  CAP 0.1uF 50V 0805  [CAP CER 0.1uF/50V 5%]
C46  CAP 22uF 50V 0805  [CAP CER 0.1uF/50V 5%]
C47  CAP 22uF 50V 0805  [CAP CER 0.1uF/50V 5%]
C48  CAP 0.1uF 50V 0805  [CAP CER 0.1uF/50V 5%]
C49  CAP 10uF 50V 0805  [CAP CER 0.1uF/50V 5%]
C50  CAP 10uF 50V 0805  [CAP CER 0.1uF/50V 5%]
C51  TANT CAP 10uF/16V 5% 3528(B)  [TANT CAP 3528(B)]
C52  CAP 0.1uF 50V 0805  [CAP CER 0.1uF/50V 5%]
C53  CAP ELE 10µF 25V TH  [CAP ELE 10µF 25V TH]
C54  CAP ELE 10µF 25V TH  [CAP ELE 10µF 25V TH]
C55  CAP 0.1uF 50V 0805  [CAP CER 0.1uF/50V 5%]
D4  DIODE M7 DO-214AC  [DIODE M7 DO-214AC]
D5  LED-0805  [LED-0805]
D17  LED-0805  [LED-0805]
D18  LED-0805  [LED-0805]
J12  2 Pin Terminal Block 5MM RA  [2 Pin Terminal Block 5MM RA]
L1  INDUCTOR 8040S SWPA8040S120MT  [INDUCTOR 8040S SWPA8040S120MT]
PS1  RFM-0505S SIP4  [RFM-0505S]
R58  RES 75K 0.25W 5% 0805  [RES 0805 10K/0.25W 5%]
R59  RES 15K 0.25W 5% 0805  [RES 0805 10K/0.25W 5%]
R60  RES 10K 0.25W 5% 0805  [RES 0805 10K/0.25W 5%]
R61  RES 10K 0.25W 5% 0805  [RES 0805 10K/0.25W 5%]
R62  RES 1K 0.25W 5% 0805  [RES 0805 10K/0.25W 5%]
R63  RES 470R 0.25W 5% 0805  [RES 0805 10K/0.25W 5%]
R64  RES 220R 0.25W 5% 0805  [RES 0805 10K/0.25W 5%]
U10  TPS54202DDCT  [TPS54202DDCT]
VR1  LM1117IMPX-3.3V SOT-223  [LM1117IMPX-3.3V SOT-223]

### Blocks framed on the sheet
POWER SUPPLY: C44-C55 D4 D5 D17 D18 J12 L1 PS1 R58-R64 U10 VR1

### Nets
3V3: C51.1 C52.2 R64.2 VR1.2(VOUT) VR1.4(VOUT)
5VDC: C53.P C55.2 PS1.4(+VOUT)
12VCC: D4.A J12.2 R62.2
+5: C46.2 C47.2 C50.2 C54.P L1.2 PS1.2(+VIN) R58.2 R63.2 VR1.3(VIN)
+12: C44.2 C48.2 C49.2 D4.C(K) R59.1 U10.3(VIN)
ERTH: C53.N C55.1 PS1.3(-VOUT)
GND: C44.1 C46.1 C47.1 C48.1 C49.1 C50.1 C51.2 C52.1 C54.N D5.C D17.C D18.C J12.1 PS1.1(-VIN) R60.1 R61.1 U10.1(GND) VR1.1(ADJ/GND)
NetC45_1: C45.1 U10.6(BOOT)
NetC45_2: C45.2 L1.1 U10.2(SW)
NetD5_A: D5.A R62.1
NetD17_A: D17.A R63.1
NetD18_A: D18.A R64.1
NetR58_1: R58.1 R61.2 U10.4(FB)
NetR59_2: R59.2 R60.2 U10.5(EN)

### Notes on the sheet
- (in symbol TANT CAP 10uF/16V 5% 3528(B)) +

### Library data of the parts
C44-C50 C52 = CAP CER 0.1uF/50V 5%: as C1 on sheet QR_Scanning_V1_STM32; Purchase-URL: https://pricing.snapeda.com/search?q=CL21B104KCFNNNE&ref=eda; Package: 0805 Samsung; Check_prices: https://www.snapeda.com/parts/CL21B104KCFNNNE/Samsung+Electro-Mechanics/view-part/?ref=eda; Value: *; SnapEDA_Link: https://www.snapeda.com/parts/CL21B104KCFNNNE/Samsung+Electro-Mechanics/view-part/?ref=snap; Digi-Key_Part_Number: 1276-6840-2-ND
C51 = TANT CAP 10uF/16V 5% 3528(B): as C3 on sheet QR_Scanning_V1_STM32; SnapEDA_Link: https://www.snapeda.com/parts/TCJB106M025R0150/AVX/view-part/?ref=snap; Package: 1210 AVX; Value: *; MP: TCJB106M025R0150; Check_prices: https://www.snapeda.com/parts/TCJB106M025R0150/AVX/view-part/?ref=eda
C53 C54 = CAP ELE 10µF 25V TH: 10µF 25V Aluminum Electrolytic Capacitors Radial Lead Type TH, Dia-5mm, Pitch-2mm ECEA1EN100UI; MF: Panasonic; Package: RADIAL-2 Panasonic; Purchase-URL: https://pricing.snapeda.com/search/part/ECEA1EN100UI/?ref=eda; Value: *; Digi-Key_Part_Number: ECE-A1EN100UI-ND; SnapEDA_Link: https://www.snapeda.com/parts/ECEA1EN100UI/Panasonic/view-part/5788532/?ref=snap; MP: ECEA1EN100UI; Check_prices: https://www.snapeda.com/parts/ECEA1EN100UI/Panasonic/view-part/5788532/?ref=eda
C55 = CAP CER 0.1uF/50V 5%: CAP CER 0.1uF/50V  Ceramic Capacitor X7R 0805 (2012 Metric); MF: Samsung; MP: CL21B104KCFNNNE; Purchase-URL: https://pricing.snapeda.com/search?q=CL21B104KCFNNNE&ref=eda; Package: 0805 Samsung; Check_prices: https://www.snapeda.com/parts/CL21B104KCFNNNE/Samsung+Electro-Mechanics/view-part/?ref=eda; Value: *; SnapEDA_Link: https://www.snapeda.com/parts/CL21B104KCFNNNE/Samsung+Electro-Mechanics/view-part/?ref=snap; Digi-Key_Part_Number: 1276-6840-2-ND
D4 = DIODE M7 DO-214AC: as D3 on sheet QR_Scanning_V1_STM32; SnapEDA_Link: https://www.snapeda.com/parts/RS2MA/Taiwan+Semiconductor/view-part/?ref=snap; Package: DO-214AC-2 Taiwan Semiconductor; Value: *; MP: RS2MA; Check_prices: https://www.snapeda.com/parts/RS2MA/Taiwan+Semiconductor/view-part/?ref=eda
D5 D17 D18 = LED-0805: as D2 on sheet QR_Scanning_V1_STM32; SnapEDA_Link: https://www.snapeda.com/parts/APT2012SRCPRV/Kingbright/view-part/?ref=snap; Package: 0805 Kingbright; Value: *; MP: APT2012SRCPRV; Check_prices: https://www.snapeda.com/parts/APT2012SRCPRV/Kingbright/view-part/?ref=eda
J12 = 2 Pin Terminal Block 5MM RA: 2 Pin Terminal Block HDR 5MM THT RA _OQ0271510000G; MF: Amphenol Anytek; SnapEDA_Link: https://www.snapeda.com/parts/OQ0271510000G/Amphenol/view-part/?ref=snap; Package: None; Value: *; MP: OQ0271510000G; Check_prices: https://www.snapeda.com/parts/OQ0271510000G/Amphenol/view-part/?ref=eda
L1 = INDUCTOR 8040S SWPA8040S120MT: SWPA8040S120MT SMD 8.0×8.0x4.0mm 8040S 12uH Â±20% 2.8A 142 mOhm SMT Shielded Wirewound Inductor; MF: Abracon LLC; MP: ASPI-8040S-510M-T; Purchase-URL: https://pricing.snapeda.com/search/part/ASPI-8040S-510M-T/?ref=eda; Value: *; SnapEDA_Link: https://www.snapeda.com/parts/ASPI-8040S-510M-T/Abracon+LLC/view-part/?ref=snap; Package: Nonstandard Abracon LLC; Check_prices: https://www.snapeda.com/parts/ASPI-8040S-510M-T/Abracon+LLC/view-part/?ref=eda; Availability: In Stock; Price: None
PS1 = RFM-0505S: DC-DC Converter/Isolator, SIP4, 1kV unreg, Single Output, 1W, 5V Out, RFM Series | RECOM Power Inc. RFM-0505S; SnapEDA_Link: https://www.snapeda.com/parts/RFM-0505S/Recom+Power/view-part/?ref=snap; Package: SIP-4 Recom Power; Value: *; MF: Recom Power; MP: RFM-0505S; Check_prices: https://www.snapeda.com/parts/RFM-0505S/Recom+Power/view-part/?ref=eda
R58-R64 = RES 10K 0.25W 5% 0805: as R1 on sheet QR_Scanning_V1_STM32; Price: None; Check_prices: https://www.snapeda.com/parts/ERJ-6GEYJ103V/Panasonic+Electronic+Components/view-part/?ref=eda; Package: 805-2 Panasonic; Purchase-URL: https://pricing.snapeda.com/search/part/ERJ-6GEYJ103V/?ref=eda; Availability: In Stock; SnapEDA_Link: https://www.snapeda.com/parts/ERJ-6GEYJ103V/Panasonic+Electronic+Components/view-part/?ref=snap; Value: *
U10 = TPS54202DDCT: 4.5V to 28V Input, 2A Output, EMI Friendly Synchronous Step-Down Converter SOT23-6; MF: Texas Instruments; SnapEDA_Link: https://www.snapeda.com/parts/TPS54202DDCT/Texas+Instruments/view-part/?ref=snap; Package: SOT-23-THN-6 Texas Instruments; Value: *; MP: TPS54202DDCT; Check_prices: https://www.snapeda.com/parts/TPS54202DDCT/Texas+Instruments/view-part/?ref=eda
VR1 = LM1117IMPX-3.3V SOT-223: LM1117IMPX-3.3V 800-mA 15-V linear voltage regulator SOT-223; MF: Texas Instruments; MP: LM1117IMPX-5.0/NOPB; SnapEDA_Link: https://www.snapeda.com/parts/LM1117IMPX-5.0/NOPB/Texas+Instruments/view-part/?ref=snap; Package: SOT-223-4 Texas Instruments; Value: *; Check_prices: https://www.snapeda.com/parts/LM1117IMPX-5.0/NOPB/Texas+Instruments/view-part/?ref=eda

## Nets that join several sheets
3V3: QR_Scanning_V1_STM32 (25 pins), QR_Scanning1_V1_STM32 (14 pins), QR_Scanning2_V1_STM32 (5 pins)
5VDC: QR_Scanning_V1_STM32 (10 pins), QR_Scanning2_V1_STM32 (C53.P C55.2 PS1.4)
+5: QR_Scanning_V1_STM32 (J2.02 J8.02), QR_Scanning1_V1_STM32 (8 pins), QR_Scanning2_V1_STM32 (9 pins)
ERTH: QR_Scanning_V1_STM32 (8 pins), QR_Scanning2_V1_STM32 (C53.N C55.1 PS1.3)
GND: QR_Scanning_V1_STM32 (36 pins), QR_Scanning1_V1_STM32 (47 pins), QR_Scanning2_V1_STM32 (18 pins)
DI_TX1: QR_Scanning_V1_STM32 (U3.42), QR_Scanning1_V1_STM32 (R53.1 U7.5)
MISO: QR_Scanning_V1_STM32 (U3.56), QR_Scanning1_V1_STM32 (J10.8 U6.34)
MOSI: QR_Scanning_V1_STM32 (U3.57), QR_Scanning1_V1_STM32 (J10.6 U6.35)
RO_RX1: QR_Scanning_V1_STM32 (U3.43), QR_Scanning1_V1_STM32 (U7.4)
RST: QR_Scanning_V1_STM32 (U3.21), QR_Scanning1_V1_STM32 (J10.5 R26.1 U6.37)
SCS: QR_Scanning_V1_STM32 (U3.58), QR_Scanning1_V1_STM32 (J10.4 R24.1 U6.32)
SWO/sck1: QR_Scanning_V1_STM32 (U3.55), QR_Scanning1_V1_STM32 (J10.2 U6.33)